# Altium project Task2.PrjPcb
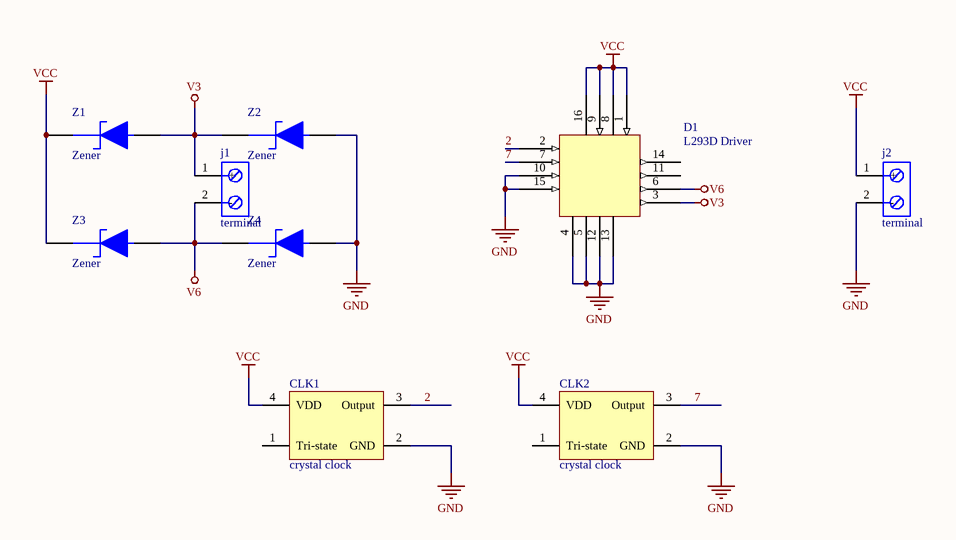
[diagram p0: Task2.SchDoc]
1 sheet, 9 parts. Net scope: global (net labels, ports and power ports of the same name join across sheets).
Board file: PCB1.PcbDoc

## Sheet Task2.SchDoc
size A4; SheetNumber: 1; SheetTotal: 1

### Parts
CLK1  crystal clock  [Crystal Oscillator]
CLK2  crystal clock  [Crystal Oscillator]
D1  L293D Driver  [Driver]
j1  terminal  [TERMINAL]
j2  terminal  [TERMINAL]
Z1  Zener  [Zener]
Z2  Zener  [Zener]
Z3  Zener  [Zener]
Z4  Zener  [Zener]

### Nets
GND: CLK1.2(GND) CLK2.2(GND) D1.4 D1.5 D1.10 D1.12 D1.13 D1.15 j2.2(-) Z2.2 Z4.2
V3: D1.3 j1.1(+) Z1.2 Z2.1
V6: D1.6 j1.2(-) Z3.2 Z4.1
VCC: CLK1.4(VDD) CLK2.4(VDD) D1.1 D1.8 D1.9 D1.16 j2.1(+) Z1.1 Z3.1
2: CLK1.3(Output) D1.2
7: CLK2.3(Output) D1.7

Not connected (* = marked no-connect by the designer): CLK1 1(Tri-state); CLK2 1(Tri-state); D1 11 14

### Library data of the parts
CLK1 CLK2 = Crystal oscillator: Oscillator XO 0.032768MHz ±25ppm 15pF 60% 3.3V 4-Pin SMD T/R; Manufacturer: Abracon; Manufacturer Part Number: ASEK-32.768KHZ-L-R-T; Supplier: Mouser; Supplier Part Number: 815-ASEK-32.7K-LRT; RoHS: No; Stock: 5543; Pricing: 1=1.33, 10=1.04, 50=1.04, 100=0.986, 1000=0.787, 10000=0.696 (USD)
D1 = L293D Driver: IC MTRDRV BIPLR 4.5-36V 16PWRDIP; Part Number: 497-2936-5-ND; ComponentLink1Description: DigiKey; ComponentLink1URL: https://www.digikey.com/en/products/detail/stmicroelectronics/L293D/634700
j1 j2 = terminal: Barrier Strip Terminal Block; Manufacturer: Wurth Electronics; Manufacturer Part Number: 691137710002; Supplier: Rs; Supplier Part Number: 1769908; RoHS: No; Category: Terminal Blocks; Stock: 355; Pricing: 500=0.218, 1000=0.202, 2500=0.189 (GBP); RoHS Compliant: Yes; ComponentLink1URL: https://datasheet.ciiva.com:443/pdfs/VipMasterIC/IC/MIDC/MIDC-S-A0005074262/MIDC-S-A0004711666-1.pdf?src-supplier=IHS+Markit; ComponentLink1Description: https://datasheet.ciiva.com:443/pdfs/VipMasterIC/IC/MIDC/MIDC-S-A0005074262/MIDC-S-A0004711666-1.pdf?src-supplier=IHS+Markit; ComponentLink2URL: https://katalog.we-online.de/em/datasheet/691137710002.pdf?src-supplier=Digikey; ComponentLink2Description: https://katalog.we-online.de/em/datasheet/691137710002.pdf?src-supplier=Digikey
Z1-Z4 = Zener: TVS DIODE 5VWM SOD923; Part Number: ESD9B5.0ST5GOSDKR-ND; ComponentLink1Description: DigiKey; ComponentLink1URL: https://www.digikey.com/en/products/detail/onsemi/ESD9B5-0ST5G/1646449